# Altium schematic sheet I2C Multiplexer.SchDoc: I2C Multiplexer
size 292 x 193 mm; SheetNumber: 9; SheetTotal: 40
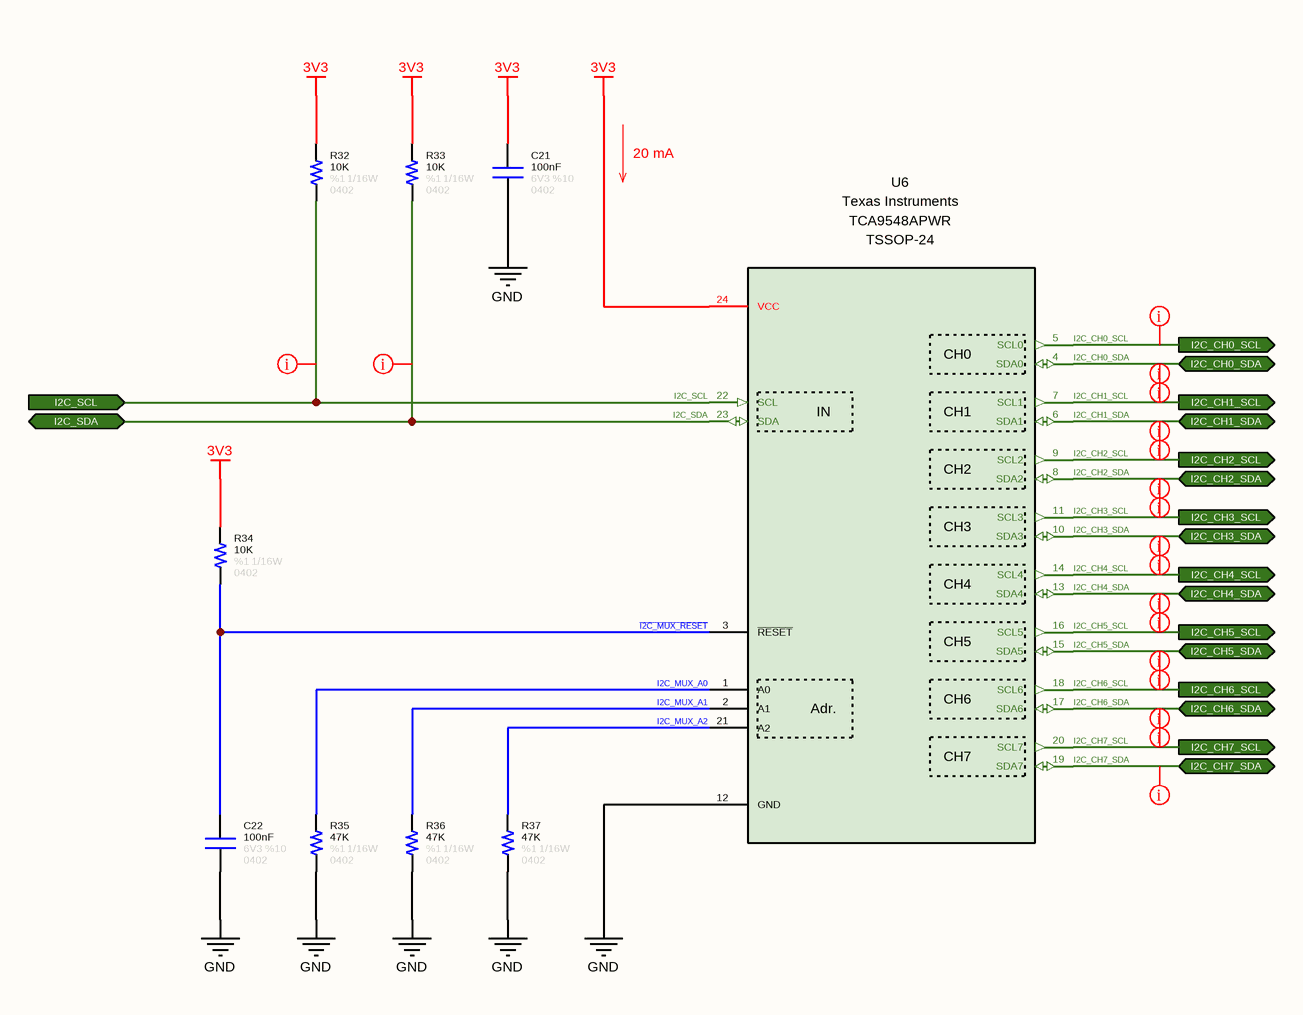
[diagram p0: I2C Multiplexer.SchDoc]

## Parts
C21  value 100nF  Tolerance: %10  Voltage: 6V3  Case: 0402  [CAPACITOR_0402]  (hidden comment: Capacitor - 100nF [0402] (Ceramic))
C22  value 100nF  Tolerance: %10  Voltage: 6V3  Case: 0402  [CAPACITOR_0402]  (hidden comment: Capacitor - 100nF [0402] (Ceramic))
R32  value 10K  Tolerance: %1  Case: 0402  Power: 1/16W  [RESISTOR_0402]  (hidden comment: 10K - 0402 - %1 - 1/16W)
R33  value 10K  Tolerance: %1  Case: 0402  Power: 1/16W  [RESISTOR_0402]  (hidden comment: 10K - 0402 - %1 - 1/16W)
R34  value 10K  Tolerance: %1  Case: 0402  Power: 1/16W  [RESISTOR_0402]  (hidden comment: 10K - 0402 - %1 - 1/16W)
R35  value 47K  Tolerance: %1  Case: 0402  Power: 1/16W  [RESISTOR_0402]  (hidden comment: 47K - 0402 - %1 - 1/16W)
R36  value 47K  Tolerance: %1  Case: 0402  Power: 1/16W  [RESISTOR_0402]  (hidden comment: 47K - 0402 - %1 - 1/16W)
R37  value 47K  Tolerance: %1  Case: 0402  Power: 1/16W  [RESISTOR_0402]  (hidden comment: 47K - 0402 - %1 - 1/16W)
U6  Manufacturer Name: Texas Instruments  [TSSOP-24]  (hidden comment: TCA9548APWR)

## Ports
I2C_CH0_SCL (out), I2C_CH0_SDA (bidir), I2C_CH1_SCL (out), I2C_CH1_SDA (bidir), I2C_CH2_SCL (out), I2C_CH2_SDA (bidir), I2C_CH3_SCL (out), I2C_CH3_SDA (bidir), I2C_CH4_SCL (out), I2C_CH4_SDA (bidir), I2C_CH5_SCL (out), I2C_CH5_SDA (bidir), I2C_CH6_SCL (out), I2C_CH6_SDA (bidir), I2C_CH7_SCL (out), I2C_CH7_SDA (bidir), I2C_SCL (in), I2C_SDA (bidir)

## Nets
3V3: C21.2 R32.2 R33.2 R34.2 U6.24(VCC)
GND: C21.1 C22.1 R35.1 R36.1 R37.1 U6.12(GND)
I2C_CH0_SCL: U6.5(SCL0) ; port I2C_CH0_SCL
I2C_CH0_SDA: U6.4(SDA0) ; port I2C_CH0_SDA
I2C_CH1_SCL: U6.7(SCL1) ; port I2C_CH1_SCL
I2C_CH1_SDA: U6.6(SDA1) ; port I2C_CH1_SDA
I2C_CH2_SCL: U6.9(SCL2) ; port I2C_CH2_SCL
I2C_CH2_SDA: U6.8(SDA2) ; port I2C_CH2_SDA
I2C_CH3_SCL: U6.11(SCL3) ; port I2C_CH3_SCL
I2C_CH3_SDA: U6.10(SDA3) ; port I2C_CH3_SDA
I2C_CH4_SCL: U6.14(SCL4) ; port I2C_CH4_SCL
I2C_CH4_SDA: U6.13(SDA4) ; port I2C_CH4_SDA
I2C_CH5_SCL: U6.16(SCL5) ; port I2C_CH5_SCL
I2C_CH5_SDA: U6.15(SDA5) ; port I2C_CH5_SDA
I2C_CH6_SCL: U6.18(SCL6) ; port I2C_CH6_SCL
I2C_CH6_SDA: U6.17(SDA6) ; port I2C_CH6_SDA
I2C_CH7_SCL: U6.20(SCL7) ; port I2C_CH7_SCL
I2C_CH7_SDA: U6.19(SDA7) ; port I2C_CH7_SDA
I2C_MUX_A0: R35.2 U6.1(A0)
I2C_MUX_A1: R36.2 U6.2(A1)
I2C_MUX_A2: R37.2 U6.21(A2)
I2C_SCL: R32.1 U6.22(SCL) ; port I2C_SCL
I2C_SDA: R33.1 U6.23(SDA) ; port I2C_SDA
~{I2C_MUX_RESET}: C22.2 R34.1 U6.3(~{RESET})

## Layout directives
net class I2C_Communication: I2C_CH0_SCL, I2C_CH0_SDA, I2C_CH1_SCL, I2C_CH1_SDA, I2C_CH2_SCL, I2C_CH2_SDA, I2C_CH3_SCL, I2C_CH3_SDA, I2C_CH4_SCL, I2C_CH4_SDA, I2C_CH5_SCL, I2C_CH5_SDA, I2C_CH6_SCL, I2C_CH6_SDA, I2C_CH7_SCL, I2C_CH7_SDA, I2C_SCL, I2C_SDA

## Notes on the sheet
- 20 mA
- © 2021 All rights reserved.
  This document may not, in whole or in part, be copied, photocopied, reproduced, translated or converted to any electronic or machine readable from without prior written permission of Mehmet Günce Akkoyun.
  Engineer contact : akkoyun@me.com
- Property of
- Engineer :
- Date :
- Size :
- A4
- Time :
- Project :
- Page :
- /
- Customer :
- Product ID :
- Module ID :
- Version :
- File :
- Revision :
- (in symbol IC - TCA9548) CH0; IN; CH1; CH2; CH3; CH4; CH5; CH6; Adr.; CH7

## Library data of the parts
C21 C22 = Capacitor - 100nF [0402-6V3]: Capacitor - 100nF [0402-6V3] (Ceramic); Manufacturer Name: AVX; Manufacturer Part Number: 04026D104KAT4A; ComponentLink1Description: Mouser; ComponentLink1URL: https://www.mouser.com.tr/ProductDetail/AVX/04026D104KAT4A?qs=sGAEpiMZZMs0AnBnWHyRQPg4iYkCw7IMED%2F4kpqgf7w%3D; ComponentLink2Description: DataSheet; ComponentLink2URL: https://www.mouser.com.tr/datasheet/2/40/cx5r-776519.pdf
R32-R34 = Resistor - 10K [0402]: Thick Film Resistors - SMD 1/16 W 10 KOhm 1%; Manufacturer Name: Vishay; Manufacturer Part Number: CRCW040210K0FKED; ComponentLink1Description: DataSheet; ComponentLink1URL: https://www.mouser.com.tr/datasheet/2/427/dcrcwe3-1762152.pdf; ComponentLink2Description: Mouser; ComponentLink2URL: https://www.mouser.com.tr/ProductDetail/Vishay-Dale/CRCW040210K0FKED?qs=sGAEpiMZZMu61qfTUdNhG2DpbjADlD3GcalbOv9utCY%3D
R35-R37 = Resistor - 47K [0402]: Thick Film Resistors - SMD 1/16 W 47 KOhm 1%; Manufacturer Name: Vishay; Manufacturer Part Number: CRCW040247K0FKED; ComponentLink1Description: DataSheet; ComponentLink1URL: https://www.mouser.com.tr/datasheet/2/427/dcrcwe3-1762152.pdf; ComponentLink2Description: Mouser; ComponentLink2URL: https://www.mouser.com.tr/ProductDetail/Vishay-Dale/CRCW040247K0FKED?qs=sGAEpiMZZMu61qfTUdNhG2DpbjADlD3GL%252B3h1elTxqU%3D
U6 = IC - TCA9548: TEXAS INSTRUMENTS - TCA9548APWR - I2C SWITCH W/ RESET, 8-CH, TSSOP-24; Supply Current - Max: 80 uA; Channel: 8; Maximum Operating Temperature: + 85 C; Minimum Operating Temperature: - 40 C; Product Type: Switch ICs; Manufacturer Part Number: TCA9548APWR; Case: TSSOP-24